# Altium project Controller.PrjPcb (part 4 of 4)

## Sheet USB to UART controller.SchDoc
size A4; SheetNumber: 5; SheetTotal: 7
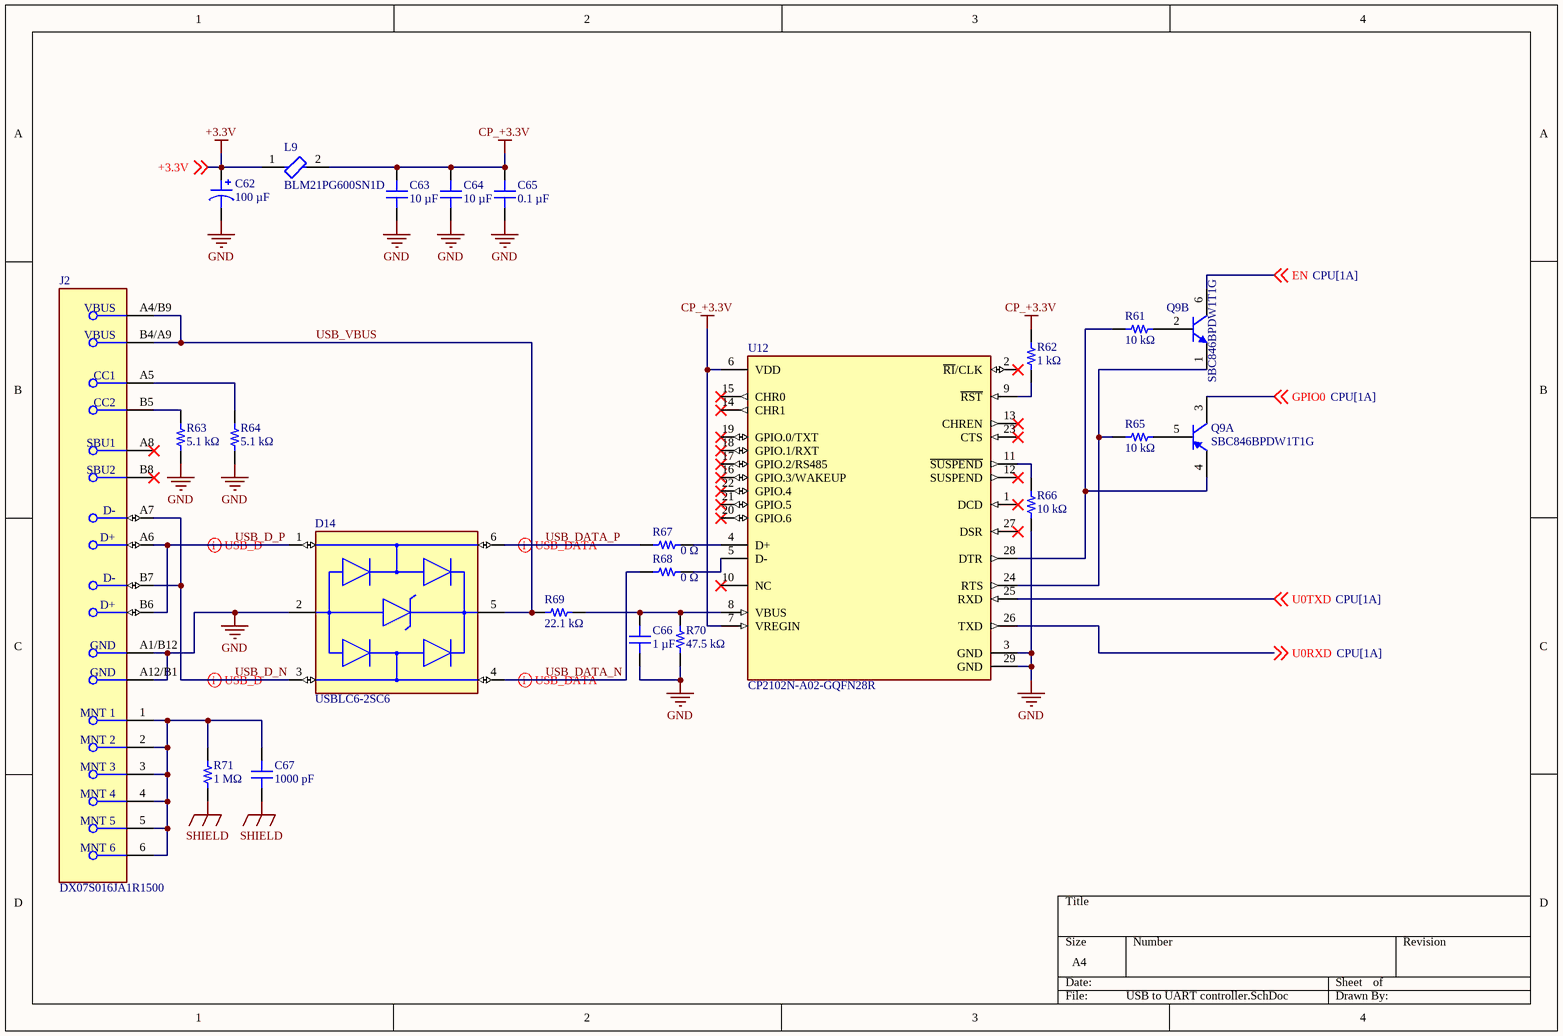
[diagram p5: USB to UART controller.SchDoc]

### Parts
C62  100 µF  [CAP POL 1411_3528]
C63  10 µF  [CAP 0805_2012]
C64  10 µF  [CAP 0805_2012]
C65  0.1 µF  [CAP 0603_1608]
C66  1 µF  [CAP 0805_2012]
C67  1000 pF  [CAP 1210_3225 - 1MM]
D14  USBLC6-2SC6  [FP-SOT-666-MFG]
J2  DX07S016JA1R1500  [FP-DX07S016JA1R1500-MFG]
L9  BLM21PG600SN1D  [FP-BLM21-0_2-t0_85-e0_5-d-IPC_A]
Q9  SBC846BPDW1T1G  [ONSC-SOT-363-6-419B-02_V]  (parts A,B of 2)
R61  10 kΩ  [RES 0603_1608]
R62  1 kΩ  [RES 0603_1608]
R63  5.1 kΩ  [RES 0603_1608]
R64  5.1 kΩ  [RES 0603_1608]
R65  10 kΩ  [RES 0603_1608]
R66  10 kΩ  [RES 0603_1608]
R67  0 Ω  [RES 0603_1608]
R68  0 Ω  [RES 0603_1608]
R69  22.1 kΩ  [RES 0603_1608]
R70  47.5 kΩ  [RES 0603_1608]
R71  1 MΩ  [RES 0805_2012]
U12  CP2102N-A02-GQFN28R  [FP-CP2102N-A02-GQFN28R-MFG]

### Nets
+3.3V: C62.1 L9.1 ; off-sheet +3.3V
CP_+3.3V: C63.2 C64.2 C65.2 L9.2 R62.2 U12.6(VDD) U12.7(VREGIN)
GND: C62.2 C63.1 C64.1 C65.1 C66.1 D14.2(GND) J2.A1/B12(GND) J2.A12/B1(GND) R63.1 R64.1 R66.1 R70.1 U12.3(GND) U12.29(GND)  [project net +12V]
SHIELD: C67.1 R71.1
EN: Q9.6(C) ; off-sheet EN
GPIO0: Q9.3(C) ; off-sheet GPIO0
U0RXD: U12.26(TXD) ; off-sheet U0RXD
U0TXD: U12.25(RXD) ; off-sheet U0TXD
USB_D_N: D14.3(I/O2) J2.A7(D-) J2.B7(D-)
USB_D_P: D14.1(I/O1) J2.A6(D+) J2.B6(D+)
USB_DATA_N: D14.4(I/O2) R68.1
USB_DATA_P: D14.6(I/O1) R67.1
USB_VBUS: D14.5(VBUS) J2.A4/B9(VBUS) J2.B4/A9(VBUS) R69.2
NetC66_2: C66.2 R69.1 R70.2 U12.8(VBUS)
NetC67_2: C67.2 J2.1(MNT_1) J2.2(MNT_2) J2.3(MNT_3) J2.4(MNT_4) J2.5(MNT_5) J2.6(MNT_6) R71.2
NetJ2_A5: J2.A5(CC1) R64.2
NetJ2_B5: J2.B5(CC2) R63.2
NetQ9_1: Q9.1(E) R65.2 U12.24(RTS)
NetQ9_2: Q9.2(B) R61.1
NetQ9_4: Q9.4(E) R61.2 U12.28(DTR)
NetQ9_5: Q9.5(B) R65.1
NetR62_1: R62.1 U12.9(~{RST})
NetR66_2: R66.2 U12.11(~{SUSPEND})
NetR67_2: R67.2 U12.4(D+)
NetR68_2: R68.2 U12.5(D-)

Not connected (* = marked no-connect by the designer): J2 A8(SBU1)* B8(SBU2)*; U12 1(DCD)* 2(~{RI}/CLK)* 10(NC)* 12(SUSPEND)* 13(CHREN)* 14(CHR1)* 15(CHR0)* 16(GPIO.3/WAKEUP)* 17(GPIO.2/RS485)* 18(GPIO.1/RXT)* 19(GPIO.0/TXT)* 20(GPIO.6)* 21(GPIO.5)* 22(GPIO.4)* 23(CTS)* 27(DSR)*

### Layout directives
differential pair: USB_D_N, USB_D_P, USB_DATA_N, USB_DATA_P

### Library data of the parts
C62 = T494B107M006AT: CAP TANT 100UF 20% 6.3V 1411; manufacturer: KEMET; Manufacturer Size Code: B; ESR (Equivalent Series Resistance): 1.5Ohm; Lifetime @ Temp.: 2000 Hrs @ 125°C; Type: Molded; Part Number: T494B107M006AT; Value: 100 µF; Capacitance: 100 µF; componentlink1description: Datasheet; componentlink1url: https://api.kemet.com/component-edge/download/datasheet/T494B107M006AT.pdf; componentlink2description: DigiKey Link; componentlink2url: https://www.digikey.com/en/products/detail/kemet/T494B107M006AT/818693; Device Package: 1411 (3528 Metric); Features: General Purpose; Height - Seated (Max): 0.083" (2.10mm); lastupdated: 3.06.2024 19:29:03; Lifecycle Status: Active; Minimum Order: 1; Mounting Type: Surface Mount; Operating Temperature: -55°C ~ 125°C; Package / Case: 1411 (3528 Metric); packaging: TapeAndReel; partid: 7; Part Status: Active; price: 0.49; series: T494; Size / Dimension: 0.138" L x 0.110" W (3.50mm x 2.80mm); Supplier 1: DigiKey; Supplier Part Number 1: 399-3833-1-ND; Tolerance: ±20%; Voltage - Rated: 6.3 V
C63 C64 = CGA4J1X7R0J106K125AC: CAP CER 10UF 6.3V X7R 0805; manufacturer: TDK Corporation; Tolerance: ±10%; Part Number: CGA4J1X7R0J106K125AC; Capacitance: 10 µF; Applications: Automotive; componentlink1description: Datasheet; componentlink1url: https://product.tdk.com/info/en/catalog/datasheets/mlcc_automotive_general_en.pdf?ref_disty=digikey; componentlink2description: DigiKey Link; componentlink2url: https://www.digikey.com/en/products/detail/tdk-corporation/CGA4J1X7R0J106K125AC/2672864; Device Package: 0805 (2012 Metric); lastupdated: 9.02.2024 20:16:07; Lifecycle Status: Active; Minimum Order: 1; Mounting Type: Surface Mount, MLCC; Operating Temperature: -55°C ~ 125°C; Package / Case: 0805 (2012 Metric); packaging: TapeAndReel; partid: 3016; Part Status: Active; price: 0.06; Ratings: AEC-Q200; series: CGA; Size / Dimension: 0.079" L x 0.049" W (2.00mm x 1.25mm); Supplier 1: DigiKey; Supplier Part Number 1: 445-6971-1-ND; Temperature Coefficient: X7R; Thickness (Max): 0.057" (1.45mm); value: 10 µF; Voltage - Rated: 6.3V
C65 = C1608X7R1H104K080AE: CAP CER 0.1UF 50V X7R 0603; manufacturer: TDK Corporation; Tolerance: ±10%; Part Number: C1608X7R1H104K080AE; Capacitance: 0.1 µF; Applications: Boardflex Sensitive; componentlink1description: Datasheet; componentlink1url: https://product.tdk.com/info/en/catalog/datasheets/mlcc_commercial_soft_en.pdf?ref_disty=digikey; componentlink2description: DigiKey Link; componentlink2url: https://www.digikey.com/en/products/detail/tdk-corporation/C1608X7R1H104K080AE/4490564; Device Package: 0603 (1608 Metric); Features: Soft Termination; lastupdated: 9.02.2024 20:10:17; Lifecycle Status: Active; Minimum Order: 1; Mounting Type: Surface Mount, MLCC; Operating Temperature: -55°C ~ 125°C; Package / Case: 0603 (1608 Metric); packaging: TapeAndReel; partid: 12789; Part Status: Active; price: 0.02; series: C; Size / Dimension: 0.063" L x 0.031" W (1.60mm x 0.80mm); Supplier 1: DigiKey; Supplier Part Number 1: 445-15927-6-ND; Temperature Coefficient: X7R; Thickness (Max): 0.037" (0.95mm); value: 0.1 µF; Voltage - Rated: 50V
C66 = C2012X7R1E105K125AB: CAP CER 1UF 25V X7R 0805; manufacturer: TDK Corporation; Tolerance: ±10%; Part Number: C2012X7R1E105K125AB; Capacitance: 1 µF; Applications: General Purpose; componentlink1description: Datasheet; componentlink1url: https://product.tdk.com/info/en/catalog/datasheets/mlcc_commercial_general_en.pdf?ref_disty=digikey; componentlink2description: DigiKey Link; componentlink2url: https://www.digikey.com/en/products/detail/tdk-corporation/C2012X7R1E105K125AB/513887; Device Package: 0805 (2012 Metric); Features: Low ESL; lastupdated: 9.02.2024 20:15:16; Lifecycle Status: Active; Minimum Order: 1; Mounting Type: Surface Mount, MLCC; Operating Temperature: -55°C ~ 125°C; Package / Case: 0805 (2012 Metric); packaging: TapeAndReel; partid: 33961; Part Status: Active; price: 0.03; series: C; Size / Dimension: 0.079" L x 0.049" W (2.00mm x 1.25mm); Supplier 1: DigiKey; Supplier Part Number 1: 445-1354-1-ND; Temperature Coefficient: X7R; Thickness (Max): 0.057" (1.45mm); value: 1 µF; Voltage - Rated: 25V
C67 = KGM32LCG3D102JU: CAP CER 1000PF 2KV C0G/NP0 1210; manufacturer: KYOCERA AVX; Temperature Coefficient: C0G, NP0; Tolerance: ±5%; Voltage - Rated: 2000V (2kV); Part Number: KGM32LCG3D102JU; Value: 1000 pF; Applications: General Purpose; Capacitance: 1000 pF; componentlink1description: Datasheet; componentlink1url: https://datasheets.kyocera-avx.com/HVKGM.pdf; componentlink2description: DigiKey Link; componentlink2url: https://www.digikey.com/en/products/detail/kyocera-avx/KGM32LCG3D102JU/11249117; Device Package: 1210 (3225 Metric); Features: High Voltage; lastupdated: 4.06.2024 19:20:42; Lifecycle Status: Active; Minimum Order: 1; Mounting Type: Surface Mount, MLCC; Operating Temperature: -55°C ~ 125°C; Package / Case: 1210 (3225 Metric); packaging: TapeAndReel; partid: 58470; price: 0.32; series: KGM - HV; Size / Dimension: 0.130" L x 0.098" W (3.30mm x 2.50mm); Supplier 1: DigiKey; Supplier Part Number 1: 478-KGM32LCG3D102JUCT-ND; Thickness (Max): 0.110" (2.80mm)
D14 = CMP-12225-000058-1: TVS DIODE 5.25V 17V SOT666; Manufacturer: STMicroelectronics; Min Breakdown Voltage: 6V; Power Line Protection: Yes; Element Configuration: Dual; Test Current: 1mA; Working Voltage: 5V; Number of Channels: 2; Max Reverse Leakage Current: 150nA; Direction: Unidirectional; Peak Pulse Current: 5A; Number of Elements: 1; Capacitance: 3.5pF; Value: 2.5pF; Data Rate: 480Mbps; Forward Voltage: 1.1V; Max Junction Temperature (Tj): 125°C; Max Breakdown Voltage: 6V; Height: 0.6mm; Depth: 1.3mm; Contact Plating: Tin; Reverse Breakdown Voltage: 6V; REACH SVHC: No SVHC; Operating Supply Voltage: 5V; Width: 1.3mm; Max Operating Temperature: 125°C; Reverse Standoff Voltage: 5V; ESD Protection: Yes; Package Quantity: 1; Termination: SMD/SMT; Length: 1.7mm; Leakage Current: 150nA; Number of Bidirectional Channels: 2; Case/Package: SOT-666; Min Operating Temperature: -40°C; Number of Pins: 6; Clamping Voltage: 17V; Breakdown Voltage: 6V; Lead Free: Lead Free; Radiation Hardening: No; Packaging: Tape and Reel; Mount: Surface Mount; Polarity: Unidirectional; Supplier: TME; Supplier Part Number: USBLC6-2SC6; Manufacturer Part Number: USBLC6-2SC6; RoHS: Compliant; Category: TVS Diodes; Stock: 48156; China RoHS: Compliant; Lifecycle Status: Production; Max Repetitive Reverse Voltage (Vrrm): 5.25V; Mounting Technology: Surface Mount; Pins: 6; Number of Terminals: 6; Peak Reverse Current: 150nA; Schedule B: 8536300000, 8536300000|8536300000|8536300000|8536300000|8536300000|8536300000|8536300000|8536300000|8536300000|8536300000|8536300000|8536300000|8536300000|8536300000|8536300000|8536300000|8536300000|8536300000|8536300000|8536300000|8536300000|8536300000|8536300000|85; ComponentLink1URL: https://datasheet.octopart.com:443/USBLC6-2SC6-STMicroelectronics-datasheet-10412581.pdf?src-supplier=Newark; ComponentLink1Description: https://datasheet.octopart.com:443/USBLC6-2SC6-STMicroelectronics-datasheet-10412581.pdf?src-supplier=Newark; ComponentLink2URL: https://datasheet.octopart.com:443/USBLC6-2SC6-STMicroelectronics-datasheet-181961833.pdf?src-supplier=Newark; ComponentLink2Description: https://datasheet.octopart.com:443/USBLC6-2SC6-STMicroelectronics-datasheet-181961833.pdf?src-supplier=Newark; ComponentLink3URL: https://datasheet.octopart.com:443/USBLC6-2SC6-STMicroelectronics-datasheet-525477.pdf?src-supplier=Factory+Futures; ComponentLink3Description: https://datasheet.octopart.com:443/USBLC6-2SC6-STMicroelectronics-datasheet-525477.pdf?src-supplier=Factory+Futures; ComponentLink4URL: https://datasheet.octopart.com:443/USBLC6-2SC6-STMicroelectronics-datasheet-82998616.pdf?src-supplier=Farnell; ComponentLink4Description: https://datasheet.octopart.com:443/USBLC6-2SC6-STMicroelectronics-datasheet-82998616.pdf?src-supplier=Farnell; ComponentLink5URL: https://datasheet.octopart.com:443/USBLC6-2SC6-STMicroelectronics-datasheet-46285.pdf?src-supplier=Farnell; ComponentLink5Description: https://datasheet.octopart.com:443/USBLC6-2SC6-STMicroelectronics-datasheet-46285.pdf?src-supplier=Farnell; ComponentLink6URL: https://datasheet.octopart.com:443/USBLC6-2SC6-STMicroelectronics-datasheet-14050643.pdf?src-supplier=iiiC; ComponentLink6Description: https://datasheet.octopart.com:443/USBLC6-2SC6-STMicroelectronics-datasheet-14050643.pdf?src-supplier=iiiC; ComponentLink7URL: https://datasheet.octopart.com:443/USBLC6-2SC6-STMicroelectronics-datasheet-10521292.pdf?src-supplier=Jameco; ComponentLink7Description: https://datasheet.octopart.com:443/USBLC6-2SC6-STMicroelectronics-datasheet-10521292.pdf?src-supplier=Jameco
J2 = CMP-19038-000003-1: CONN RCP USB2.0 TYP C 24P SMD RA
L9 = CMP-0686-00616-3: Chip Ferrite Bead, 0805, 60Ω @ 100MHz, 0.02Ω, 25%, 3.5A; DC Resistance-Max: 20mR; Number of Circuits: 1; Impedance: 60R; DC Current: 3A; Shielding: Unshielded; Material: Steel; Military Standard: Not; DC Resistance (DCR): 20mR; Core Material: Ferrite; Termination: SMD/SMT; Max Operating Temperature: 125°C; Max Current Rating: 3.5A; Length: 2mm; Packaging: Tape and Reel; Case Code (Metric): 2012; Series: BLM21P; REACH SVHC: No SVHC; Width: 1.25mm; Current Rating: 3.5A; Height: 0.85mm; RoHS Compliant: Yes; Case Code (Imperial): 0805; Radiation Hardening: No; Frequency: 100MHz; Package Quantity: 1; Depth: 1.25mm; Tolerance: 25%; Number of Lines: 1; Lead Free: Lead Free; Case/Package: 0805; Min Operating Temperature: -55°C; Max DC Current: 3A; Number of Pins: 2; Test Frequency: 100MHz
Q9 = CMP-1048-00842-1: Dual General Purpose Transistors, NPN / PNP (Complementary), 6-Pin SOT-363, Pb-Free, Tape and Reel; Manufacturer: On Semiconductor; IC Continuous (A): 0.1; fT Min (MHz): 100; ComponentLink2Description: Datasheet; RoHS: TRUE; ComponentLink2URL: http://www.onsemi.cn/pub_link/Collateral/BC846BPDW1T1-D.PDF; ComponentLink1Description: Manufacturer URL; ComponentLink1URL: http://www.onsemi.com/; Mounting Technology: Surface Mount; PackageVersion: Rev. Y, 12/2012; Packing: Tape and Reel; Polarity: Complementary; ComponentLink3URL: http://www.onsemi.cn/pub_link/Collateral/419B-02.PDF; DatasheetVersion: Rev. 9; PackageDescription: 6-Pin Small Outline Transistor, Body 2 x 1.25 mm, Pitch 0.65 mm; ComponentLink3Description: Package Specification; PartNumber: SBC846BPDW1T1G; PackageReference: SOT-363-6-419B-02
R61 R65 R66 = CRCW060310K0FKEA: RES SMD 10K OHM 1% 1/10W 0603; Manufacturer: Vishay Dale; Power (Watts): 0.1W, 1/10W; Resistance: 10 kOhms; Temperature Coefficient: ±100ppm/°C; Part Number: CRCW060310K0FKEA; Value: 10 kΩ; ComponentLink1Description: Datasheet; ComponentLink1URL: http://www.vishay.com/docs/20035/dcrcwe3.pdf; ComponentLink2Description: DigiKey Link; ComponentLink2URL: https://www.digikey.com/en/products/detail/vishay-dale/CRCW060310K0FKEA/1174782; Composition: Thick Film; Device Package: 0603 (1608 Metric); Features: Automotive AEC-Q200; Height - Seated (Max): 0.020" (0.50mm); LastUpdated: 9.02.2024 20:42:10; Lifecycle Status: Active; Minimum Order: 1; Number of Terminations: 2; Operating Temperature: -55°C ~ 155°C; Package / Case: 0603 (1608 Metric); Packaging: CutTape; PartId: 24636; Part Status: Active; Price: 0.01; Ratings: AEC-Q200; Series: CRCW; Size / Dimension: 0.061" L x 0.033" W (1.55mm x 0.85mm); Supplier 1: DigiKey; Supplier Part Number 1: 541-10.0KHCT-ND; Supplier Device Package: 0603; Tolerance: ±1%
R62 = CRCW06031K00FKEA: RES SMD 1K OHM 1% 1/10W 0603; Manufacturer: Vishay Dale; Power (Watts): 0.1W, 1/10W; Resistance: 1 kOhms; Temperature Coefficient: ±100ppm/°C; Part Number: CRCW06031K00FKEA; Value: 1 kΩ; ComponentLink1Description: Datasheet; ComponentLink1URL: http://www.vishay.com/docs/20035/dcrcwe3.pdf; ComponentLink2Description: DigiKey Link; ComponentLink2URL: https://www.digikey.com/en/products/detail/vishay-dale/CRCW06031K00FKEA/1174668; Composition: Thick Film; Device Package: 0603 (1608 Metric); Features: Automotive AEC-Q200; Height - Seated (Max): 0.020" (0.50mm); LastUpdated: 9.02.2024 20:42:10; Lifecycle Status: Active; Minimum Order: 1; Number of Terminations: 2; Operating Temperature: -55°C ~ 155°C; Package / Case: 0603 (1608 Metric); Packaging: CutTape; PartId: 24637; Part Status: Active; Price: 0.01; Ratings: AEC-Q200; Series: CRCW; Size / Dimension: 0.061" L x 0.033" W (1.55mm x 0.85mm); Supplier 1: DigiKey; Supplier Part Number 1: 541-1.00KHCT-ND; Supplier Device Package: 0603; Tolerance: ±1%
R63 R64 = CRCW06035K10FKEA: RES SMD 5.1K OHM 1% 1/10W 0603; Manufacturer: Vishay Dale; Power (Watts): 0.1W, 1/10W; Temperature Coefficient: ±100ppm/°C; Part Number: CRCW06035K10FKEA; Value: 5.1 kΩ; ComponentLink1Description: Datasheet; ComponentLink1URL: http://www.vishay.com/docs/20035/dcrcwe3.pdf; ComponentLink2Description: DigiKey Link; ComponentLink2URL: https://www.digikey.com/en/products/detail/vishay-dale/CRCW06035K10FKEA/1174748; Composition: Thick Film; Device Package: 0603 (1608 Metric); Features: Automotive AEC-Q200; Height - Seated (Max): 0.020" (0.50mm); LastUpdated: 9.02.2024 20:43:06; Lifecycle Status: Active; Minimum Order: 1; Number of Terminations: 2; Operating Temperature: -55°C ~ 155°C; Package / Case: 0603 (1608 Metric); Packaging: CutTape; PartId: 12590; Part Status: Active; Price: 0.01; Ratings: AEC-Q200; Resistance: 5.1 kΩ; Series: CRCW; Size / Dimension: 0.061" L x 0.033" W (1.55mm x 0.85mm); Supplier 1: DigiKey; Supplier Part Number 1: 541-5.10KHCT-ND; Supplier Device Package: 0603; Tolerance: ±1%
R67 R68 = ERJ-3GEY0R00V: RES SMD 0 OHM JUMPER 1/10W 0603; Manufacturer: Panasonic Electronic Components; Power (Watts): 0.1W, 1/10W; Part Number: ERJ-3GEY0R00V; Value: 0 Ω; ComponentLink1Description: Datasheet; ComponentLink1URL: http://industrial.panasonic.com/www-cgi/jvcr13pz.cgi?E+PZ+3+AOA0001+ERJ3GEY0R00V+7+WW; ComponentLink2Description: DigiKey Link; ComponentLink2URL: https://www.digikey.com/en/products/detail/panasonic-electronic-components/ERJ-3GEY0R00V/135656; Composition: Thick Film; Device Package: 0603 (1608 Metric); Features: Automotive AEC-Q200; Height - Seated (Max): 0.022" (0.55mm); LastUpdated: 9.02.2024 20:42:26; Lifecycle Status: Active; Minimum Order: 1; Number of Terminations: 2; Operating Temperature: -55°C ~ 155°C; Package / Case: 0603 (1608 Metric); Packaging: CutTape; PartId: 22603; Part Status: Active; Price: 0.01; Ratings: AEC-Q200; Resistance: 0 Ω; Series: ERJ-3G; Size / Dimension: 0.063" L x 0.031" W (1.60mm x 0.80mm); Supplier 1: DigiKey; Supplier Part Number 1: P0.0GCT-ND; Supplier Device Package: 0603; Tolerance: Jumper
R69 = CRCW060322K1FKEA: RES SMD 22.1K OHM 1% 1/10W 0603; Manufacturer: Vishay Dale; Power (Watts): 0.1W, 1/10W; Temperature Coefficient: ±100ppm/°C; Part Number: CRCW060322K1FKEA; Value: 22.1 kΩ; ComponentLink1Description: Datasheet; ComponentLink1URL: http://www.vishay.com/docs/20035/dcrcwe3.pdf; ComponentLink2Description: DigiKey Link; ComponentLink2URL: https://www.digikey.com/en/products/detail/vishay-dale/CRCW060322K1FKEA/1174819; Composition: Thick Film; Device Package: 0603 (1608 Metric); Features: Automotive AEC-Q200; Height - Seated (Max): 0.020" (0.50mm); LastUpdated: 9.02.2024 20:43:05; Lifecycle Status: Active; Minimum Order: 1; Number of Terminations: 2; Operating Temperature: -55°C ~ 155°C; Package / Case: 0603 (1608 Metric); Packaging: CutTape; PartId: 12700; Part Status: Active; Price: 0.01; Ratings: AEC-Q200; Resistance: 22.1 kΩ; Series: CRCW; Size / Dimension: 0.061" L x 0.033" W (1.55mm x 0.85mm); Supplier 1: DigiKey; Supplier Part Number 1: 541-22.1KHCT-ND; Supplier Device Package: 0603; Tolerance: ±1%
R70 = CRCW060347K5FKEA: RES SMD 47.5K OHM 1% 1/10W 0603; Manufacturer: Vishay Dale; Power (Watts): 0.1W, 1/10W; Temperature Coefficient: ±100ppm/°C; Part Number: CRCW060347K5FKEA; Value: 47.5 kΩ; ComponentLink1Description: Datasheet; ComponentLink1URL: http://www.vishay.com/docs/20035/dcrcwe3.pdf; ComponentLink2Description: DigiKey Link; ComponentLink2URL: https://www.digikey.com/en/products/detail/vishay-dale/CRCW060347K5FKEA/1174859; Composition: Thick Film; Device Package: 0603 (1608 Metric); Features: Automotive AEC-Q200; Height - Seated (Max): 0.020" (0.50mm); LastUpdated: 9.02.2024 20:43:05; Lifecycle Status: Active; Minimum Order: 1; Number of Terminations: 2; Operating Temperature: -55°C ~ 155°C; Package / Case: 0603 (1608 Metric); Packaging: TapeAndReel; PartId: 12602; Part Status: Active; Price: 0.01; Ratings: AEC-Q200; Resistance: 47.5 kΩ; Series: CRCW; Size / Dimension: 0.061" L x 0.033" W (1.55mm x 0.85mm); Supplier 1: DigiKey; Supplier Part Number 1: 541-47.5KHCT-ND; Supplier Device Package: 0603; Tolerance: ±1%
R71 = RCS08051M00FKEA: RES SMD 1M OHM 1% 1/2W 0805; Manufacturer: Vishay Dale; Power (Watts): 0.5W, 1/2W; Temperature Coefficient: ±100ppm/°C; Part Number: RCS08051M00FKEA; Value: 1 MΩ; ComponentLink1Description: Datasheet; ComponentLink1URL: http://www.vishay.com/docs/20065/rcse3.pdf; ComponentLink2Description: DigiKey Link; ComponentLink2URL: https://www.digikey.com/en/products/detail/vishay-dale/RCS08051M00FKEA/5866999; Composition: Thick Film; Device Package: 0805 (2012 Metric); Features: Automotive AEC-Q200, Pulse Withstanding; Height - Seated (Max): 0.020" (0.50mm); LastUpdated: 8.02.2024 21:02:38; Lifecycle Status: Active; Minimum Order: 1; Number of Terminations: 2; Operating Temperature: -55°C ~ 155°C; Package / Case: 0805 (2012 Metric); Packaging: TapeAndReel; PartId: 27791; Part Status: Active; Price: 0.02; Ratings: AEC-Q200; Resistance: 1 MΩ; Series: RCS e3; Size / Dimension: 0.079" L x 0.049" W (2.00mm x 1.25mm); Supplier 1: DigiKey; Supplier Part Number 1: 541-2853-1-ND; Supplier Device Package: 0805; Tolerance: ±1%
U12 = CMP-08093-000007-1: IC USB TO UART BRIDGE QFN28

## Sheet CPU.SchDoc
size A4; SheetNumber: 6; SheetTotal: 7
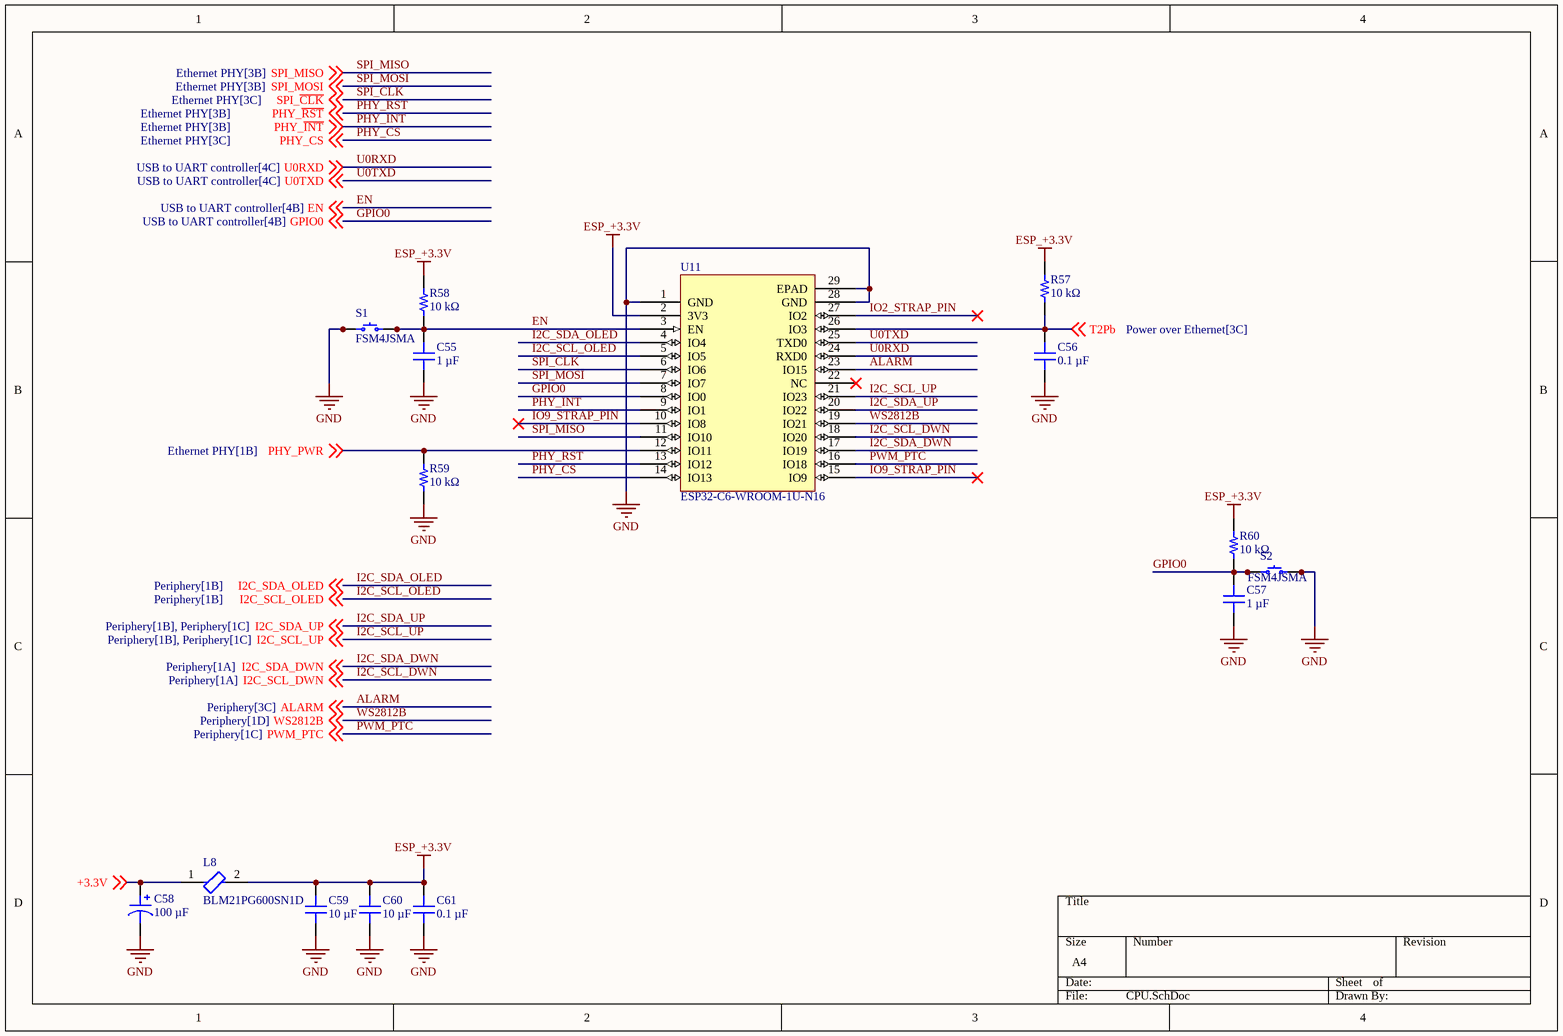
[diagram p6: CPU.SchDoc]

### Parts
C55  1 µF  [CAP 0805_2012]
C56  0.1 µF  [CAP 0603_1608]
C57  1 µF  [CAP 0805_2012]
C58  100 µF  [CAP POL 1411_3528]
C59  10 µF  [CAP 0805_2012]
C60  10 µF  [CAP 0805_2012]
C61  0.1 µF  [CAP 0603_1608]
L8  BLM21PG600SN1D  [FP-BLM21-0_2-t0_85-e0_5-d-IPC_A]
R57  10 kΩ  [RES 0603_1608]
R58  10 kΩ  [RES 0603_1608]
R59  10 kΩ  [RES 0603_1608]
R60  10 kΩ  [RES 0603_1608]
S1  FSM4JSMA  [TE FSM4JSMA]
S2  FSM4JSMA  [TE FSM4JSMA]
U11  ESP32-C6-WROOM-1U-N16  [ESP32-C6-WROOM-1U]

### Nets
+3.3V: C58.1 L8.1 ; off-sheet +3.3V
ESP_+3.3V: C59.2 C60.2 C61.2 L8.2 R57.2 R58.2 R60.2 U11.2(3V3)
GND: C55.1 C56.1 C57.1 C58.2 C59.1 C60.1 C61.1 R59.1 S1.1 S1.2 S2.3 S2.4 U11.1(GND) U11.28(GND) U11.29(EPAD)  [project net +12V]
ALARM: U11.23(IO15) ; off-sheet ALARM
EN: C55.2 R58.1 S1.3 S1.4 U11.3(EN) ; off-sheet EN
GPIO0: C57.2 R60.1 S2.1 S2.2 U11.8(IO0) ; off-sheet GPIO0
I2C_SCL_DWN: U11.18(IO20) ; off-sheet I2C_SCL_DWN
I2C_SCL_OLED: U11.5(IO5) ; off-sheet I2C_SCL_OLED
I2C_SCL_UP: U11.21(IO23) ; off-sheet I2C_SCL_UP
I2C_SDA_DWN: U11.17(IO19) ; off-sheet I2C_SDA_DWN
I2C_SDA_OLED: U11.4(IO4) ; off-sheet I2C_SDA_OLED
I2C_SDA_UP: U11.20(IO22) ; off-sheet I2C_SDA_UP
IO2_STRAP_PIN: U11.27(IO2)
IO9_STRAP_PIN: U11.10(IO8) U11.15(IO9)
PHY_CS: U11.14(IO13) ; off-sheet PHY_CS
PHY_~{INT}: U11.9(IO1) ; off-sheet PHY_~{INT}
PHY_PWR: R59.2 U11.12(IO11) ; off-sheet PHY_PWR
PHY_~{RST}: U11.13(IO12) ; off-sheet PHY_~{RST}
PWM_PTC: U11.16(IO18) ; off-sheet PWM_PTC
SPI_~{CLK}: U11.6(IO6) ; off-sheet SPI_~{CLK}
SPI_MISO: U11.11(IO10) ; off-sheet SPI_MISO
SPI_MOSI: U11.7(IO7) ; off-sheet SPI_MOSI
T2Pb: C56.2 R57.1 U11.26(IO3) ; off-sheet T2Pb
U0RXD: U11.24(RXD0) ; off-sheet U0RXD
U0TXD: U11.25(TXD0) ; off-sheet U0TXD
WS2812B: U11.19(IO21) ; off-sheet WS2812B

Not connected (* = marked no-connect by the designer): U11 22(NC)*

### Library data of the parts
C55 C57 = C2012X7R1E105K125AB: as C66 on sheet USB to UART controller; Part Number: C2012X7R1E105K125AB; Capacitance: 1 µF; Applications: General Purpose; componentlink1description: Datasheet; componentlink1url: https://product.tdk.com/info/en/catalog/datasheets/mlcc_commercial_general_en.pdf?ref_disty=digikey; componentlink2description: DigiKey Link; componentlink2url: https://www.digikey.com/en/products/detail/tdk-corporation/C2012X7R1E105K125AB/513887; Device Package: 0805 (2012 Metric); Features: Low ESL; lastupdated: 9.02.2024 20:15:16; Lifecycle Status: Active; Minimum Order: 1; Mounting Type: Surface Mount, MLCC; Operating Temperature: -55°C ~ 125°C; Package / Case: 0805 (2012 Metric); packaging: TapeAndReel; partid: 33961; Part Status: Active; price: 0.03; series: C; Size / Dimension: 0.079" L x 0.049" W (2.00mm x 1.25mm); Supplier 1: DigiKey; Supplier Part Number 1: 445-1354-1-ND; Temperature Coefficient: X7R; Thickness (Max): 0.057" (1.45mm); value: 1 µF; Voltage - Rated: 25V
C56 C61 = C1608X7R1H104K080AE: as C65 on sheet USB to UART controller; Part Number: C1608X7R1H104K080AE; Capacitance: 0.1 µF; Applications: Boardflex Sensitive; componentlink1description: Datasheet; componentlink1url: https://product.tdk.com/info/en/catalog/datasheets/mlcc_commercial_soft_en.pdf?ref_disty=digikey; componentlink2description: DigiKey Link; componentlink2url: https://www.digikey.com/en/products/detail/tdk-corporation/C1608X7R1H104K080AE/4490564; Device Package: 0603 (1608 Metric); Features: Soft Termination; lastupdated: 9.02.2024 20:10:17; Lifecycle Status: Active; Minimum Order: 1; Mounting Type: Surface Mount, MLCC; Operating Temperature: -55°C ~ 125°C; Package / Case: 0603 (1608 Metric); packaging: TapeAndReel; partid: 12789; Part Status: Active; price: 0.02; series: C; Size / Dimension: 0.063" L x 0.031" W (1.60mm x 0.80mm); Supplier 1: DigiKey; Supplier Part Number 1: 445-15927-6-ND; Temperature Coefficient: X7R; Thickness (Max): 0.037" (0.95mm); value: 0.1 µF; Voltage - Rated: 50V
C58 = T494B107M006AT: as C62 on sheet USB to UART controller; Part Number: T494B107M006AT; Value: 100 µF; Capacitance: 100 µF; componentlink1description: Datasheet; componentlink1url: https://api.kemet.com/component-edge/download/datasheet/T494B107M006AT.pdf; componentlink2description: DigiKey Link; componentlink2url: https://www.digikey.com/en/products/detail/kemet/T494B107M006AT/818693; Device Package: 1411 (3528 Metric); Features: General Purpose; Height - Seated (Max): 0.083" (2.10mm); lastupdated: 3.06.2024 19:29:03; Lifecycle Status: Active; Minimum Order: 1; Mounting Type: Surface Mount; Operating Temperature: -55°C ~ 125°C; Package / Case: 1411 (3528 Metric); packaging: TapeAndReel; partid: 7; Part Status: Active; price: 0.49; series: T494; Size / Dimension: 0.138" L x 0.110" W (3.50mm x 2.80mm); Supplier 1: DigiKey; Supplier Part Number 1: 399-3833-1-ND; Tolerance: ±20%; Voltage - Rated: 6.3 V
C59 C60 = CGA4J1X7R0J106K125AC: as C63 on sheet USB to UART controller; Part Number: CGA4J1X7R0J106K125AC; Capacitance: 10 µF; Applications: Automotive; componentlink1description: Datasheet; componentlink1url: https://product.tdk.com/info/en/catalog/datasheets/mlcc_automotive_general_en.pdf?ref_disty=digikey; componentlink2description: DigiKey Link; componentlink2url: https://www.digikey.com/en/products/detail/tdk-corporation/CGA4J1X7R0J106K125AC/2672864; Device Package: 0805 (2012 Metric); lastupdated: 9.02.2024 20:16:07; Lifecycle Status: Active; Minimum Order: 1; Mounting Type: Surface Mount, MLCC; Operating Temperature: -55°C ~ 125°C; Package / Case: 0805 (2012 Metric); packaging: TapeAndReel; partid: 3016; Part Status: Active; price: 0.06; Ratings: AEC-Q200; series: CGA; Size / Dimension: 0.079" L x 0.049" W (2.00mm x 1.25mm); Supplier 1: DigiKey; Supplier Part Number 1: 445-6971-1-ND; Temperature Coefficient: X7R; Thickness (Max): 0.057" (1.45mm); value: 10 µF; Voltage - Rated: 6.3V
L8 = CMP-0686-00616-3: as L9 on sheet USB to UART controller; Military Standard: Not; DC Resistance (DCR): 20mR; Core Material: Ferrite; Termination: SMD/SMT; Max Operating Temperature: 125°C; Max Current Rating: 3.5A; Length: 2mm; Packaging: Tape and Reel; Case Code (Metric): 2012; Series: BLM21P; REACH SVHC: No SVHC; Width: 1.25mm; Current Rating: 3.5A; Height: 0.85mm; RoHS Compliant: Yes; Case Code (Imperial): 0805; Radiation Hardening: No; Frequency: 100MHz; Package Quantity: 1; Depth: 1.25mm; Tolerance: 25%; Number of Lines: 1; Lead Free: Lead Free; Case/Package: 0805; Min Operating Temperature: -55°C; Max DC Current: 3A; Number of Pins: 2; Test Frequency: 100MHz
R57-R60 = CRCW060310K0FKEA: as R61 on sheet USB to UART controller; Part Number: CRCW060310K0FKEA; Value: 10 kΩ; ComponentLink1Description: Datasheet; ComponentLink1URL: http://www.vishay.com/docs/20035/dcrcwe3.pdf; ComponentLink2Description: DigiKey Link; ComponentLink2URL: https://www.digikey.com/en/products/detail/vishay-dale/CRCW060310K0FKEA/1174782; Composition: Thick Film; Device Package: 0603 (1608 Metric); Features: Automotive AEC-Q200; Height - Seated (Max): 0.020" (0.50mm); LastUpdated: 9.02.2024 20:42:10; Lifecycle Status: Active; Minimum Order: 1; Number of Terminations: 2; Operating Temperature: -55°C ~ 155°C; Package / Case: 0603 (1608 Metric); Packaging: CutTape; PartId: 24636; Part Status: Active; Price: 0.01; Ratings: AEC-Q200; Series: CRCW; Size / Dimension: 0.061" L x 0.033" W (1.55mm x 0.85mm); Supplier 1: DigiKey; Supplier Part Number 1: 541-10.0KHCT-ND; Supplier Device Package: 0603; Tolerance: ±1%
S1 S2 = FSM4JSMA: SWITCH TACTILE SPST-NO 0.05A 24V; Manufacturer: TE Connectivity ALCOSWITCH Switches; Actuator Height off PCB, Vertical: 5.00mm; Actuator Orientation: Top Actuated; Actuator Type: Standard; Contact Rating @ Voltage: 0.05A @ 24VDC; Illumination: Non-Illuminated; Operating Force: 160gf; Outline: 6.00mm x 6.00mm; Switch Function: Off-Mom; Part Number: FSM4JSMA; Circuit: SPST-NO; ComponentLink1Description: Datasheet; ComponentLink1URL: https://www.te.com/commerce/DocumentDelivery/DDEController?Action=srchrtrv&DocNm=1308111-1_SWITCHES_CORE_PROGRAM_CATALOG&DocType=CS&DocLang=English; ComponentLink2Description: DigiKey Link; ComponentLink2URL: https://www.digikey.com/en/products/detail/te-connectivity-alcoswitch-switches/FSM4JSMA/525821; LastUpdated: 3.06.2024 20:19:31; Lifecycle Status: Active; Minimum Order: 1; Mounting Type: Surface Mount; Operating Temperature: -35°C ~ 85°C; Packaging: Bulk; Part Status: Active; Price: 0.14; Series: FSMJSMA; Supplier 1: DigiKey; Supplier Part Number 1: 450-1129-ND; Termination Style: Gull Wing
U11 = ESP32-C6-WROOM-1U-N16: Supplier 1: TME; Supplier Part Number 1: ESP32C6-WROOM1UN16

## Sheet Periphery.SchDoc
size A4; SheetNumber: 7; SheetTotal: 7
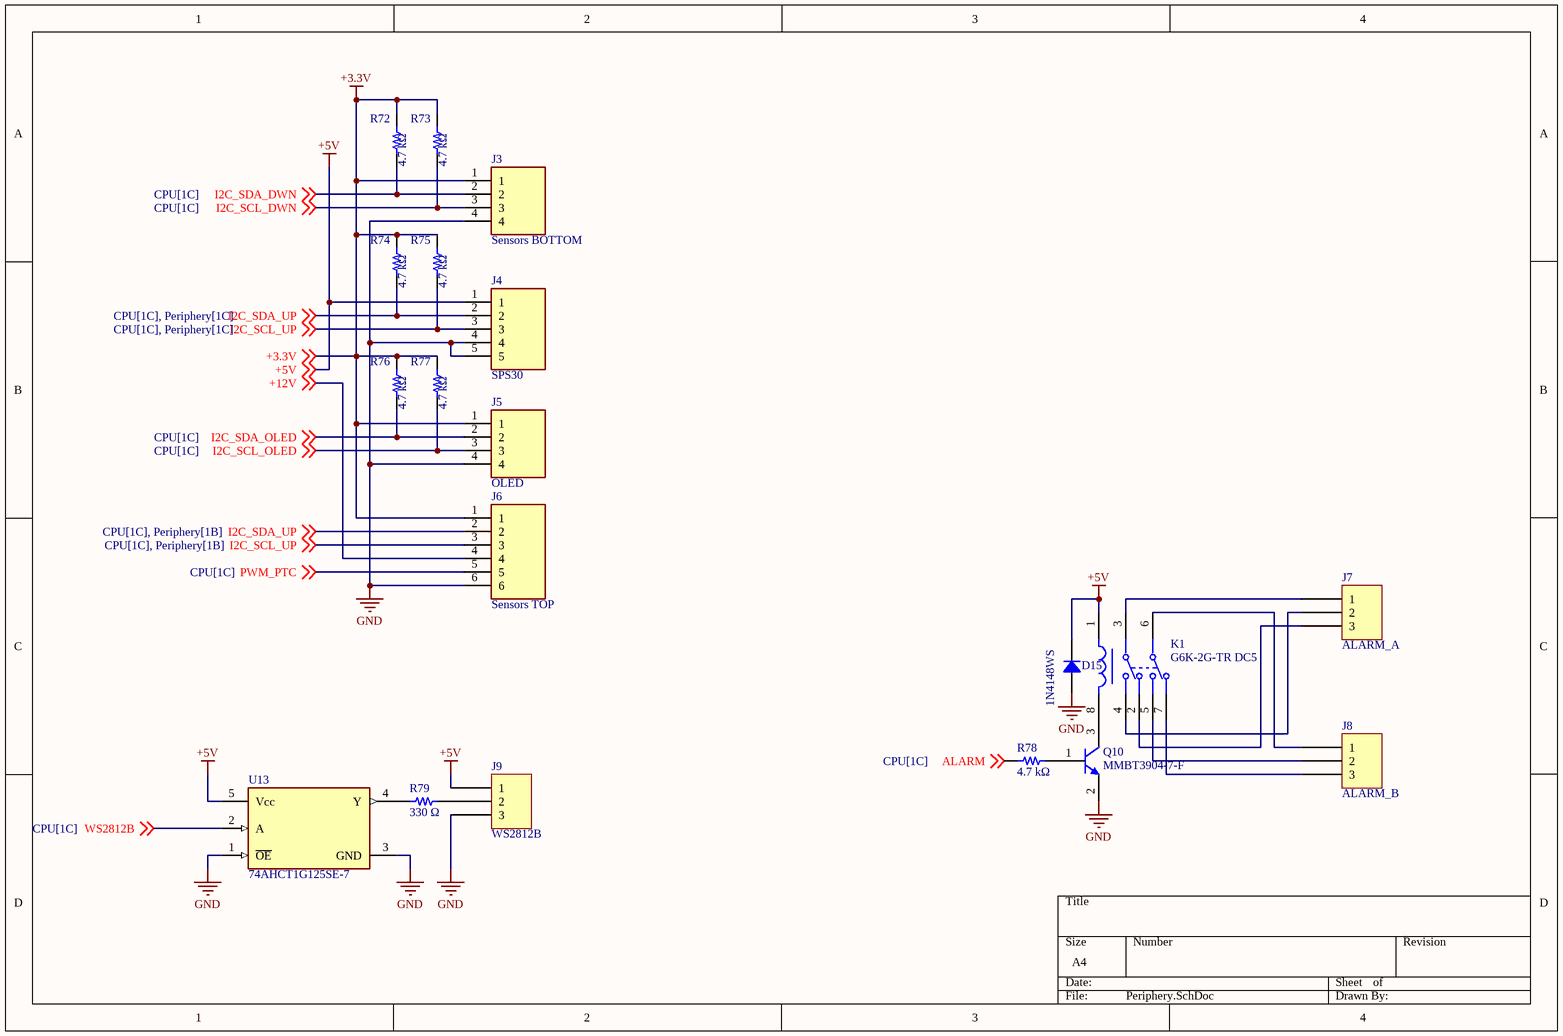
[diagram p7: Periphery.SchDoc]

### Parts
D15  1N4148WS  [SOD323F]
J3  Sensors BOTTOM  [SHDR4W50P0X150_1X4_750X350X450P]
J4  SPS30  [SHDR5W50P0X150_1X5_900X350X450P]
J5  OLED  [SHDR4W50P0X150_1X4_750X350X450P]
J6  Sensors TOP  [SHDR6W50P0X150_1X6_1050X350X450P]
J7  ALARM_A  [MOLEX KK 0022272031]
J8  ALARM_B  [MOLEX KK 0022272031]
J9  WS2812B  [MOLEX KK 0022272031]
K1  G6K-2G-TR DC5  [FP-G6K-2G-TR_DC5-MFG]
Q10  MMBT3904-7-F  [DIODES SOT-23-3]
R72  4.7 kΩ  [RES 0603_1608]
R73  4.7 kΩ  [RES 0603_1608]
R74  4.7 kΩ  [RES 0603_1608]
R75  4.7 kΩ  [RES 0603_1608]
R76  4.7 kΩ  [RES 0603_1608]
R77  4.7 kΩ  [RES 0603_1608]
R78  4.7 kΩ  [RES 0603_1608]
R79  330 Ω  [RES 0603_1608]
U13  74AHCT1G125SE-7  [FP-SOT353-IPC_A]

### Nets
+3.3V: J3.1 J5.1 J6.1 R72.2 R73.2 R74.2 R75.2 R76.2 R77.2 ; off-sheet +3.3V
+5V: D15.2 J4.1 J9.1 K1.1 U13.5(Vcc) ; off-sheet +5V
+12V: D15.1 J3.4 J4.4 J4.5 J5.4 J6.4 J6.6 J9.3 Q10.2(E) U13.1(~{OE}) U13.3(GND) ; off-sheet +12V  [also labelled GND]
ALARM: R78.1 ; off-sheet ALARM
I2C_SCL_DWN: J3.3 R73.1 ; off-sheet I2C_SCL_DWN
I2C_SCL_OLED: J5.3 R77.1 ; off-sheet I2C_SCL_OLED
I2C_SCL_UP: J4.3 J6.3 R75.1 ; off-sheet I2C_SCL_UP
I2C_SDA_DWN: J3.2 R72.1 ; off-sheet I2C_SDA_DWN
I2C_SDA_OLED: J5.2 R76.1 ; off-sheet I2C_SDA_OLED
I2C_SDA_UP: J4.2 J6.2 R74.1 ; off-sheet I2C_SDA_UP
PWM_PTC: J6.5 ; off-sheet PWM_PTC
WS2812B: U13.2(A) ; off-sheet WS2812B
NetJ7_1: J7.1 K1.3
NetJ7_2: J7.2 K1.4
NetJ7_3: J7.3 K1.2
NetJ8_1: J8.1 K1.6
NetJ8_2: J8.2 K1.5
NetJ8_3: J8.3 K1.7
NetJ9_2: J9.2 R79.2
NetK1_8: K1.8 Q10.3(C)
NetQ10_1: Q10.1(B) R78.2
NetR79_1: R79.1 U13.4(Y)

### Library data of the parts
D15 = 1N4148WS: DIODE GEN PURP 75V 150MA SOD323F; Manufacturer: ON Semiconductor; Current - Reverse Leakage @ Vr: 5µA @ 75V; Diode Type: Standard; Reverse Recovery Time (trr): 4ns; Speed: Small Signal =< 200mA (Io), Any Speed; Voltage - Forward (Vf) (Max) @ If: 1V @ 10mA; Part Number: 1N4148WS; ComponentLink1Description: Datasheet; ComponentLink1URL: https://www.onsemi.com/pub/Collateral/1N914BWS-D.pdf; ComponentLink2Description: DigiKey Link; ComponentLink2URL: http://digikey.com/product-detail/en/on-semiconductor/1N4148WS/1N4148WSFSCT-ND/1873821; Current - Average Rectified (Io): 150mA; LastUpdated: 3.06.2024 19:55:04; Lifecycle Status: Active; Minimum Order: 1; Mounting Type: Surface Mount; Operating Temperature - Junction: 150°C (Max); Package / Case: SC-90, SOD-323F; Packaging: TapeAndReel; PartId: 1158; Part Status: Active; Price: 0.03; Series: -; Supplier 1: DigiKey; Supplier Part Number 1: 1N4148WSFSCT-ND; Supplier Device Package: SOD-323F; Voltage - DC Reverse (Vr) (Max): 75V
J3 J5 = B4B-ZR: JST (JAPAN SOLDERLESS TERMINALS) - B4B-ZR(LF)(SN) - HEADER, TOP ENTRY, 4WAY; Geometry.Height: 4.5mm; Manufacturer_Name: JST (JAPAN SOLDERLESS TERMINALS); Manufacturer_Part_Number: B4B-ZR(LF)(SN); Mouser Part Number: 306-B4B-ZRLFSN; Mouser Price/Stock: https://www.mouser.co.uk/ProductDetail/JST-Commercial/B4B-ZRLFSN?qs=QpmGXVUTftFM%252B0QwnoJl9g%3D%3D; Arrow Part Number: B4B-ZR(LF)(SN); Arrow Price/Stock: https://www.arrow.com/en/products/b4b-zr-lf-sn/jst-manufacturing?region=europe; Datasheet Link: https://datasheet.datasheetarchive.com/originals/distributors/Datasheets_SAMA/cb62f9f85e77727a538b6695add69f99.pdf; Supplier 1: DigiKey; Supplier Part Number 1: 455-1659-ND
J4 = B5B-ZR: CONN HEADER VERT 5POS 1.5MM; Manufacturer_Name: JST (JAPAN SOLDERLESS TERMINALS); Manufacturer_Part_Number: B5B-ZR(LF)(SN); Geometry.Height: 4.5mm; Mouser Part Number: N/A; Mouser Price/Stock: https://www.mouser.co.uk/ProductDetail/JST-Commercial/B5B-ZRLFSN?qs=IKkN%2F947nfC1UhZj5V253g%3D%3D; Arrow Part Number: B5B-ZR(LF)(SN); Arrow Price/Stock: https://www.arrow.com/en/products/b5b-zr-lf-sn/jst-manufacturing?region=europe; Datasheet Link: https://datasheet.lcsc.com/szlcsc/JST-Sales-America-B5B-ZR-LF-SN_C157990.pdf; Supplier 1: DigiKey; Supplier Part Number 1: 455-1660-ND
J6 = B6B-ZR: CONN HEADER ZH TOP 6POS 1.5MM; Manufacturer_Name: JST (JAPAN SOLDERLESS TERMINALS); Geometry.Height: 4.5mm; Manufacturer_Part_Number: B6B-ZR; Mouser Part Number: N/A; Mouser Price/Stock: https://www.mouser.co.uk/ProductDetail/JST/B6B-ZR?qs=BJlw7L4Cy7%2FnnkhPIMLEpQ%3D%3D; Arrow Part Number: *; Arrow Price/Stock: *; Datasheet Link: http://www.jst-mfg.com/product/pdf/eng/eZH.pdf; Supplier 1: DigiKey; Supplier Part Number 1: 455-B6B-ZR-ND
J7-J9 = 0022272031: CONN HEADER VERT 3POS 2.54MM; Manufacturer: Molex; Contact Length - Mating: 0.295" (7.49mm); Contact Length - Post: 0.140" (3.56mm); Material Flammability Rating: UL94 V-0; Number of Positions: 3; Number of Positions Loaded: All; Overall Contact Length: 0.560" (14.22mm); Pitch - Mating: 0.100" (2.54mm); Shrouding: Shrouded - 1 Wall; Style: Board to Cable/Wire; Part Number: 0022272031; ComponentLink1Description: Datasheet; ComponentLink1URL: https://www.molex.com/pdm_docs/sd/022272031_sd.pdf; ComponentLink2Description: DigiKey Link; ComponentLink2URL: http://digikey.com/product-detail/en/molex/0022272031/WM4112-ND/1130578; Connector Type: Header; Contact Finish - Mating: Tin; Contact Finish - Post: Tin; Contact Finish Thickness - Mating: 100.0µin (2.54µm); Contact Material: Brass; Contact Shape: Square; Contact Type: Male Pin; Fastening Type: Friction Lock; Insulation Color: Natural; Insulation Height: 0.461" (11.70mm); Insulation Material: Polyamide (PA), Nylon; LastUpdated: 12.01.2020 23:51:54; Lifecycle Status: Active; Minimum Order: 1; Mounting Type: Through Hole; Number of Rows: 1; Packaging: Bulk; PartId: 77; Part Status: Active; Price: 0.37; Series: KK 6410; Supplier 1: DigiKey; Supplier Part Number 1: WM4112-ND; Termination: Solder
K1 = CMP-08823-000110-1: RELAY TELECOM DPDT 1A 5VDC; RoHS Compliant: Yes
Q10 = MMBT3904-7-F: TRANS NPN 40V 0.2A SOT23-3; Manufacturer: Diodes Incorporated; Current - Collector Cutoff (Max): 50nA (ICBO); Current - Collector (Ic) (Max): 200 mA; DC Current Gain (hFE) (Min) @ Ic, Vce: 100 @ 10mA, 1V; Frequency - Transition: 300MHz; Power - Max: 300 mW; Vce Saturation (Max) @ Ib, Ic: 300mV @ 5mA, 50mA; Part Number: MMBT3904-7-F; ComponentLink1Description: Datasheet; ComponentLink1URL: https://www.diodes.com/assets/Datasheets/ds30036.pdf; ComponentLink2Description: DigiKey Link; ComponentLink2URL: https://www.digikey.com/en/products/detail/diodes-incorporated/MMBT3904-7-F/814494; LastUpdated: 3.06.2024 20:24:11; Lifecycle Status: Active; Minimum Order: 1; Mounting Type: Surface Mount; Operating Temperature: -55°C ~ 150°C (TJ); Package / Case: TO-236-3, SC-59, SOT-23-3; Packaging: TapeAndReel; PartId: 85; Part Status: Active; Price: 0.01; Series: -; Supplier 1: DigiKey; Supplier Part Number 1: MMBT3904-FDICT-ND; Supplier Device Package: SOT-23-3; Transistor Type: NPN; Voltage - Collector Emitter Breakdown (Max): 40 V
R72-R78 = CRCW06034K70FKEA: RES SMD 4.7K OHM 1% 1/10W 0603; Manufacturer: Vishay Dale; Power (Watts): 0.1W, 1/10W; Temperature Coefficient: ±100ppm/°C; Part Number: CRCW06034K70FKEA; Value: 4.7 kΩ; ComponentLink1Description: Datasheet; ComponentLink1URL: http://www.vishay.com/docs/20035/dcrcwe3.pdf; ComponentLink2Description: DigiKey Link; ComponentLink2URL: https://www.digikey.com/en/products/detail/vishay-dale/CRCW06034K70FKEA/1174744; Composition: Thick Film; Device Package: 0603 (1608 Metric); Features: Automotive AEC-Q200; Height - Seated (Max): 0.020" (0.50mm); LastUpdated: 9.02.2024 20:43:25; Lifecycle Status: Active; Minimum Order: 1; Number of Terminations: 2; Operating Temperature: -55°C ~ 155°C; Package / Case: 0603 (1608 Metric); Packaging: CutTape; PartId: 7812; Part Status: Active; Price: 0.01; Ratings: AEC-Q200; Resistance: 4.7 kΩ; Series: CRCW; Size / Dimension: 0.061" L x 0.033" W (1.55mm x 0.85mm); Supplier 1: DigiKey; Supplier Part Number 1: 541-4.70KHCT-ND; Supplier Device Package: 0603; Tolerance: ±1%
R79 = CRCW0603330RFKEA: RES SMD 330 OHM 1% 1/10W 0603; Manufacturer: Vishay Dale; Power (Watts): 0.1W, 1/10W; Temperature Coefficient: ±100ppm/°C; Part Number: CRCW0603330RFKEA; Value: 330 Ω; ComponentLink1Description: Datasheet; ComponentLink1URL: http://www.vishay.com/docs/20035/dcrcwe3.pdf; ComponentLink2Description: DigiKey Link; ComponentLink2URL: https://www.digikey.com/en/products/detail/vishay-dale/CRCW0603330RFKEA/1174611; Composition: Thick Film; Device Package: 0603 (1608 Metric); Features: Automotive AEC-Q200; Height - Seated (Max): 0.020" (0.50mm); LastUpdated: 9.02.2024 20:43:06; Lifecycle Status: Active; Minimum Order: 1; Number of Terminations: 2; Operating Temperature: -55°C ~ 155°C; Package / Case: 0603 (1608 Metric); Packaging: CutTape; PartId: 12596; Part Status: Active; Price: 0.01; Ratings: AEC-Q200; Resistance: 330 Ω; Series: CRCW; Size / Dimension: 0.061" L x 0.033" W (1.55mm x 0.85mm); Supplier 1: DigiKey; Supplier Part Number 1: 541-330HCT-ND; Supplier Device Package: 0603; Tolerance: ±1%
U13 = CMP-12739-000002-1: IC BUF NON-INVERT 5.5V SOT353; Logic Function: Buffer; Output Type: PUSH-PULL; Number of Bits per Element: 1; Operating Supply Voltage: 5V; Polarity: Non-Inverting; Turn-On Delay Time: 11ns; Min Supply Voltage: 4.5V; Low Level Output Current: 8mA; Quiescent Current: 1uA; High Level Output Current: -8mA; Packaging: Tape and Reel; Technology: CMOS; Number of Functions: 1; Min Operating Temperature: -40°C; Number of Pins: 5; Max Operating Temperature: 125°C; Package Quantity: 3000; Supply Voltage-Nom: 5.5V; Number of Channels: 1; Propagation Delay: 11ns; Max Supply Voltage: 5.5V; Case/Package: SOT-353; Radiation Hardening: No; Mount: Surface Mount; REACH SVHC: No SVHC; RoHS Compliant: Yes; Lead Free: Lead Free; Series: 74AHCT; Number of Outputs: 1; Number of Inputs: 1; Number of Elements: 1

## Nets that join several sheets
+3.3V: Power adapter (C36.2 C37.2 L6.2 R32.2), Ethernet PHY (6 pins), USB to UART controller (C62.1 L9.1), CPU (C58.1 L8.1), Periphery (9 pins)
+5V: Power adapter (C31.2 C32.2 L5.2 R30.2), Periphery (5 pins)
+12V: Ethernet interface (U2.2), Power over Ethernet (20 pins), Power adapter (20 pins), Alternate power (C71.2 L12.2), Ethernet PHY (16 pins), USB to UART controller (14 pins), CPU (15 pins), Periphery (11 pins)
PGND: Power over Ethernet (21 pins), Alternate power (C69.1 C71.1 L11.2 L13.2)
SHIELD: Ethernet interface (8 pins), USB to UART controller (C67.1 R71.1)
ACT_A: Ethernet interface (J1.12), Ethernet PHY (R36.1)
ACT_K: Ethernet interface (J1.11), Ethernet PHY (U10.27)
ALARM: CPU (U11.23), Periphery (R78.1)
AUX: Power over Ethernet (R22.2), Alternate power (C68.2 J10.1 L10.1)
CT_RX_C: Ethernet interface (U1.15), Ethernet PHY (C47.1)
CT_RX_N: Ethernet interface (U1.14 U2.5), Ethernet PHY (R48.3 R52.2)
CT_RX_P: Ethernet interface (U1.16 U2.4), Ethernet PHY (R48.4 R53.2)
CT_TX_C: Ethernet interface (U1.10), Ethernet PHY (C48.2 R42.1)
CT_TX_N: Ethernet interface (U1.9 U2.3), Ethernet PHY (R43.1 R48.1)
CT_TX_P: Ethernet interface (U1.11 U2.1), Ethernet PHY (R44.1 R48.2)
EN: USB to UART controller (Q9.6), CPU (5 pins)
GPIO0: USB to UART controller (Q9.3), CPU (5 pins)
I2C_SCL_DWN: CPU (U11.18), Periphery (J3.3 R73.1)
I2C_SCL_OLED: CPU (U11.5), Periphery (J5.3 R77.1)
I2C_SCL_UP: CPU (U11.21), Periphery (J4.3 J6.3 R75.1)
I2C_SDA_DWN: CPU (U11.17), Periphery (J3.2 R72.1)
I2C_SDA_OLED: CPU (U11.4), Periphery (J5.2 R76.1)
I2C_SDA_UP: CPU (U11.20), Periphery (J4.2 J6.2 R74.1)
LNK_A: Ethernet interface (J1.10), Ethernet PHY (R40.1)
LNK_K: Ethernet interface (J1.9), Ethernet PHY (U10.25)
PHY_CS: Ethernet PHY (R47.2), CPU (U11.14)
PHY_~{INT}: Ethernet PHY (R39.2), CPU (U11.9)
PHY_PWR: Ethernet PHY (Q8.1), CPU (R59.2 U11.12)
PHY_~{RST}: Ethernet PHY (R38.2), CPU (U11.13)
PWM_PTC: CPU (U11.16), Periphery (J6.5)
SPI_~{CLK}: Ethernet PHY (R46.2), CPU (U11.6)
SPI_MISO: Ethernet PHY (R45.2), CPU (U11.11)
SPI_MOSI: Ethernet PHY (R41.2), CPU (U11.7)
T2Pb: Power over Ethernet (U7.4), CPU (C56.2 R57.1 U11.26)
U0RXD: USB to UART controller (U12.26), CPU (U11.24)
U0TXD: USB to UART controller (U12.25), CPU (U11.25)
VDD: Ethernet interface (C6.1 D3.1 L1.2), Power over Ethernet (5 pins), Alternate power (C69.2 L10.2)
VSS: Ethernet interface (C6.2 D3.2 L1.4), Power over Ethernet (R28.1 U5.10 U5.21)
WS2812B: CPU (U11.19), Periphery (U13.2)